# Altium schematic sheet [0X] - CPU - DISP, CSI.SchDoc
size A2
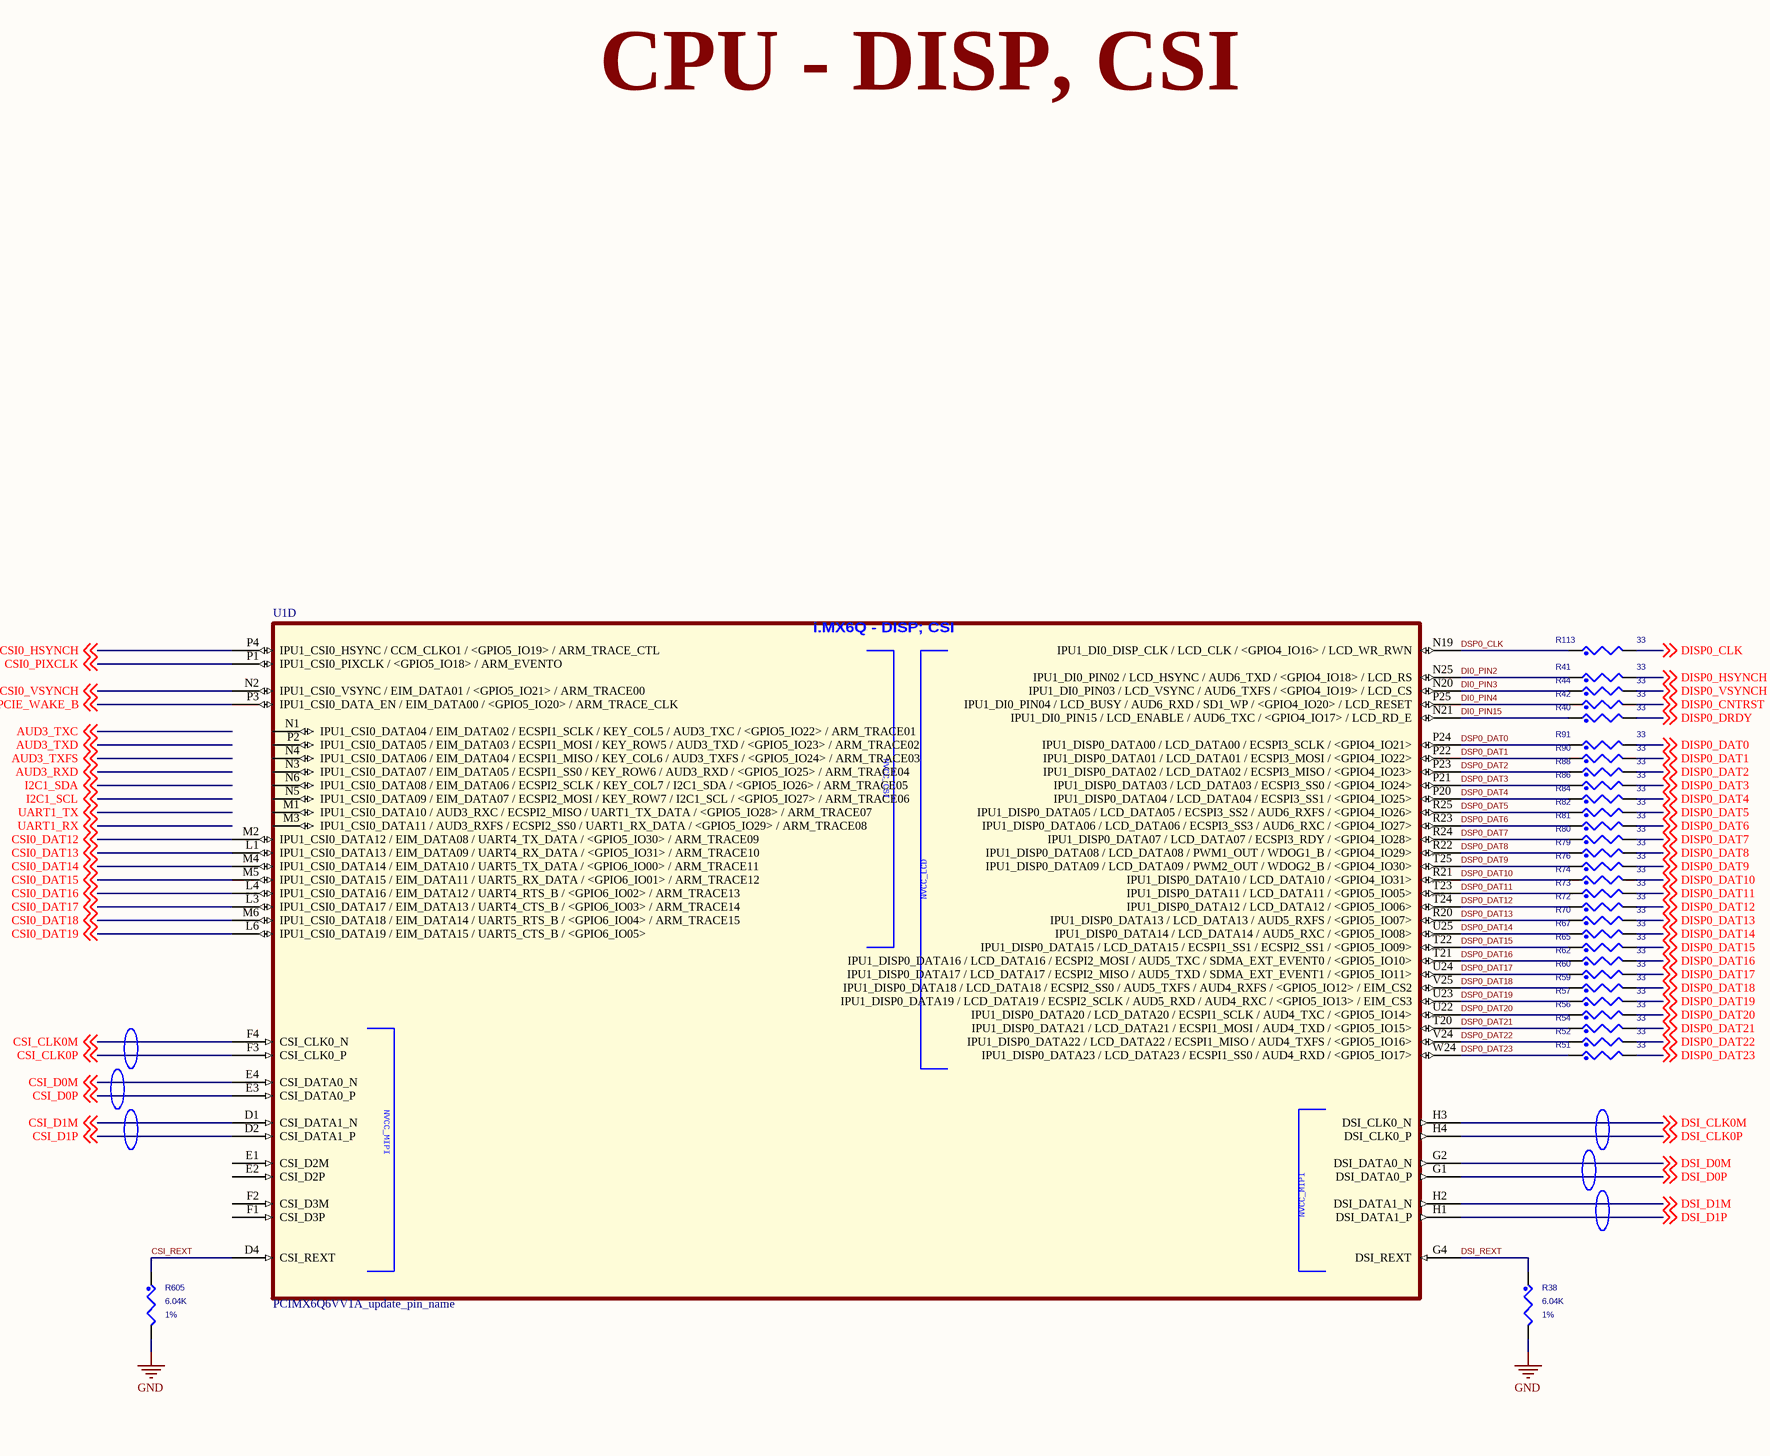
[diagram p0: [0X] - CPU - DISP, CSI.SchDoc, left]
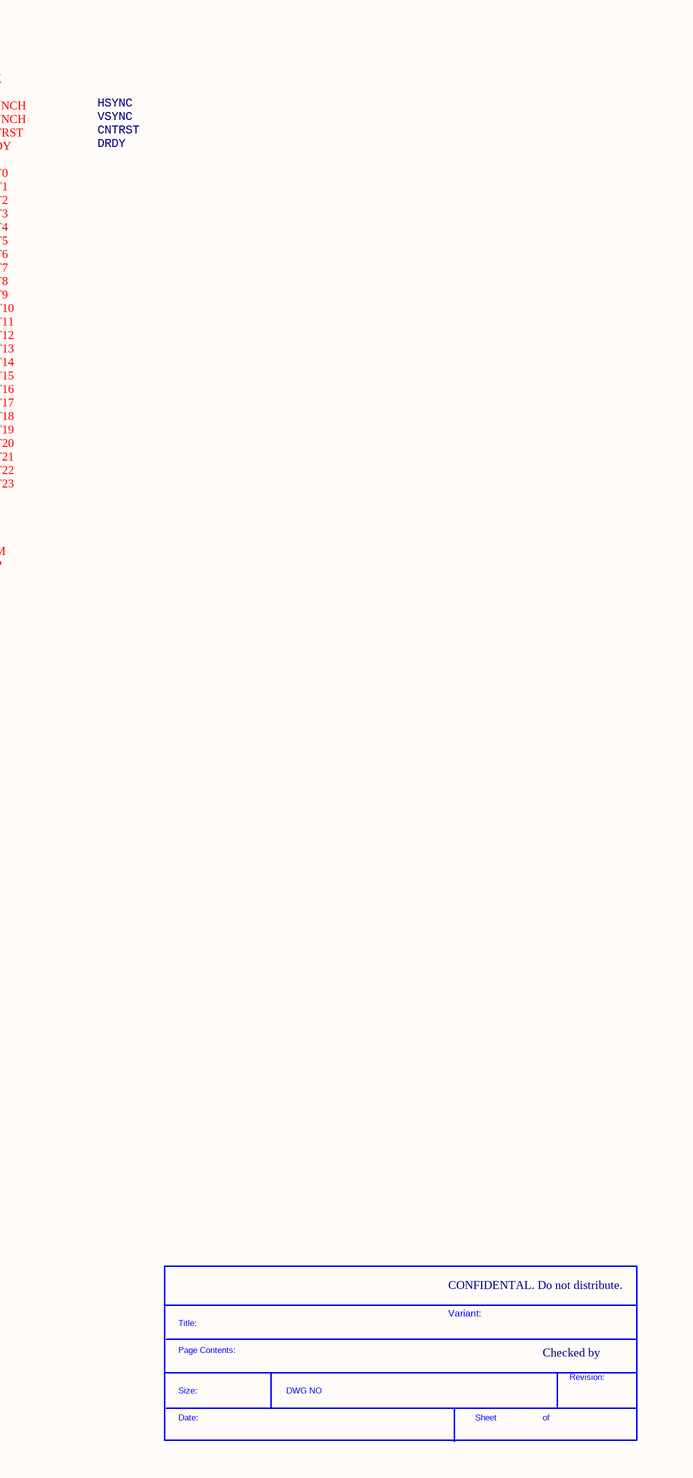
[diagram p1: [0X] - CPU - DISP, CSI.SchDoc, right]

## Parts
*  SDTitleBlock  (value not drawn)  (graphical)
R38  6.04K  Tolerance: 1%  [0402_CC]
R40  33  [0402_CC]
R41  33  [0402_CC]
R42  33  [0402_CC]
R44  33  [0402_CC]
R51  33  [0402_CC]
R52  33  [0402_CC]
R54  33  [0402_CC]
R56  33  [0402_CC]
R57  33  [0402_CC]
R59  33  [0402_CC]
R60  33  [0402_CC]
R62  33  [0402_CC]
R65  33  [0402_CC]
R67  33  [0402_CC]
R70  33  [0402_CC]
R72  33  [0402_CC]
R73  33  [0402_CC]
R74  33  [0402_CC]
R76  33  [0402_CC]
R79  33  [0402_CC]
R80  33  [0402_CC]
R81  33  [0402_CC]
R82  33  [0402_CC]
R84  33  [0402_CC]
R86  33  [0402_CC]
R88  33  [0402_CC]
R90  33  [0402_CC]
R91  33  [0402_CC]
R113  33  [0402_CC]
R605  6.04K  Tolerance: 1%  [0402_CC]
U1  PCIMX6Q6VV1A_update_pin_name  (part D of 17)

## Nets
GND: R38.2 R605.2
CSI0_DAT12: U1.M2(IPU1_CSI0_DATA12_/_EIM_DATA08_/_UART4_TX_DATA_/_<GPIO5_IO30>_/_ARM_TRACE09) ; off-sheet CSI0_DAT12
CSI0_DAT13: U1.L1(IPU1_CSI0_DATA13_/_EIM_DATA09_/_UART4_RX_DATA_/_<GPIO5_IO31>_/_ARM_TRACE10) ; off-sheet CSI0_DAT13
CSI0_DAT14: U1.M4(IPU1_CSI0_DATA14_/_EIM_DATA10_/_UART5_TX_DATA_/_<GPIO6_IO00>_/_ARM_TRACE11) ; off-sheet CSI0_DAT14
CSI0_DAT15: U1.M5(IPU1_CSI0_DATA15_/_EIM_DATA11_/_UART5_RX_DATA_/_<GPIO6_IO01>_/_ARM_TRACE12) ; off-sheet CSI0_DAT15
CSI0_DAT16: U1.L4(IPU1_CSI0_DATA16_/_EIM_DATA12_/_UART4_RTS_B_/_<GPIO6_IO02>_/_ARM_TRACE13) ; off-sheet CSI0_DAT16
CSI0_DAT17: U1.L3(IPU1_CSI0_DATA17_/_EIM_DATA13_/_UART4_CTS_B_/_<GPIO6_IO03>_/_ARM_TRACE14) ; off-sheet CSI0_DAT17
CSI0_DAT18: U1.M6(IPU1_CSI0_DATA18_/_EIM_DATA14_/_UART5_RTS_B_/_<GPIO6_IO04>_/_ARM_TRACE15) ; off-sheet CSI0_DAT18
CSI0_DAT19: U1.L6(IPU1_CSI0_DATA19_/_EIM_DATA15_/_UART5_CTS_B_/_<GPIO6_IO05>) ; off-sheet CSI0_DAT19
CSI0_HSYNCH: U1.P4(IPU1_CSI0_HSYNC_/_CCM_CLKO1_/_<GPIO5_IO19>_/_ARM_TRACE_CTL) ; off-sheet CSI0_HSYNCH
CSI0_PIXCLK: U1.P1(IPU1_CSI0_PIXCLK_/_<GPIO5_IO18>_/_ARM_EVENTO) ; off-sheet CSI0_PIXCLK
CSI0_VSYNCH: U1.N2(IPU1_CSI0_VSYNC_/_EIM_DATA01_/_<GPIO5_IO21>_/_ARM_TRACE00) ; off-sheet CSI0_VSYNCH
CSI_CLK0M: U1.F4(CSI_CLK0_N) ; off-sheet CSI_CLK0M
CSI_CLK0P: U1.F3(CSI_CLK0_P) ; off-sheet CSI_CLK0P
CSI_D0M: U1.E4(CSI_DATA0_N) ; off-sheet CSI_D0M
CSI_D0P: U1.E3(CSI_DATA0_P) ; off-sheet CSI_D0P
CSI_D1M: U1.D1(CSI_DATA1_N) ; off-sheet CSI_D1M
CSI_D1P: U1.D2(CSI_DATA1_P) ; off-sheet CSI_D1P
CSI_REXT: R605.1 U1.D4(CSI_REXT)
DI0_PIN2: R41.1 U1.N25(IPU1_DI0_PIN02_/_LCD_HSYNC_/_AUD6_TXD_/_<GPIO4_IO18>_/_LCD_RS)
DI0_PIN3: R44.1 U1.N20(IPU1_DI0_PIN03_/_LCD_VSYNC_/_AUD6_TXFS_/_<GPIO4_IO19>_/_LCD_CS)
DI0_PIN4: R42.1 U1.P25(IPU1_DI0_PIN04_/_LCD_BUSY_/_AUD6_RXD_/_SD1_WP_/_<GPIO4_IO20>_/_LCD_RESET)
DI0_PIN15: R40.1 U1.N21(IPU1_DI0_PIN15_/_LCD_ENABLE_/_AUD6_TXC_/_<GPIO4_IO17>_/_LCD_RD_E)
DISP0_CLK: R113.2 ; off-sheet DISP0_CLK
DISP0_CNTRST: R42.2 ; off-sheet DISP0_CNTRST
DISP0_DAT0: R91.2 ; off-sheet DISP0_DAT0
DISP0_DAT1: R90.2 ; off-sheet DISP0_DAT1
DISP0_DAT2: R88.2 ; off-sheet DISP0_DAT2
DISP0_DAT3: R86.2 ; off-sheet DISP0_DAT3
DISP0_DAT4: R84.2 ; off-sheet DISP0_DAT4
DISP0_DAT5: R82.2 ; off-sheet DISP0_DAT5
DISP0_DAT6: R81.2 ; off-sheet DISP0_DAT6
DISP0_DAT7: R80.2 ; off-sheet DISP0_DAT7
DISP0_DAT8: R79.2 ; off-sheet DISP0_DAT8
DISP0_DAT9: R76.2 ; off-sheet DISP0_DAT9
DISP0_DAT10: R74.2 ; off-sheet DISP0_DAT10
DISP0_DAT11: R73.2 ; off-sheet DISP0_DAT11
DISP0_DAT12: R72.2 ; off-sheet DISP0_DAT12
DISP0_DAT13: R70.2 ; off-sheet DISP0_DAT13
DISP0_DAT14: R67.2 ; off-sheet DISP0_DAT14
DISP0_DAT15: R65.2 ; off-sheet DISP0_DAT15
DISP0_DAT16: R62.2 ; off-sheet DISP0_DAT16
DISP0_DAT17: R60.2 ; off-sheet DISP0_DAT17
DISP0_DAT18: R59.2 ; off-sheet DISP0_DAT18
DISP0_DAT19: R57.2 ; off-sheet DISP0_DAT19
DISP0_DAT20: R56.2 ; off-sheet DISP0_DAT20
DISP0_DAT21: R54.2 ; off-sheet DISP0_DAT21
DISP0_DAT22: R52.2 ; off-sheet DISP0_DAT22
DISP0_DAT23: R51.2 ; off-sheet DISP0_DAT23
DISP0_DRDY: R40.2 ; off-sheet DISP0_DRDY
DISP0_HSYNCH: R41.2 ; off-sheet DISP0_HSYNCH
DISP0_VSYNCH: R44.2 ; off-sheet DISP0_VSYNCH
DSI_CLK0M: U1.H3(DSI_CLK0_N) ; off-sheet DSI_CLK0M
DSI_CLK0P: U1.H4(DSI_CLK0_P) ; off-sheet DSI_CLK0P
DSI_D0M: U1.G2(DSI_DATA0_N) ; off-sheet DSI_D0M
DSI_D0P: U1.G1(DSI_DATA0_P) ; off-sheet DSI_D0P
DSI_D1M: U1.H2(DSI_DATA1_N) ; off-sheet DSI_D1M
DSI_D1P: U1.H1(DSI_DATA1_P) ; off-sheet DSI_D1P
DSI_REXT: R38.1 U1.G4(DSI_REXT)
DSP0_CLK: R113.1 U1.N19(IPU1_DI0_DISP_CLK_/_LCD_CLK_/_<GPIO4_IO16>_/_LCD_WR_RWN)
DSP0_DAT0: R91.1 U1.P24(IPU1_DISP0_DATA00_/_LCD_DATA00_/_ECSPI3_SCLK_/_<GPIO4_IO21>)
DSP0_DAT1: R90.1 U1.P22(IPU1_DISP0_DATA01_/_LCD_DATA01_/_ECSPI3_MOSI_/_<GPIO4_IO22>)
DSP0_DAT2: R88.1 U1.P23(IPU1_DISP0_DATA02_/_LCD_DATA02_/_ECSPI3_MISO_/_<GPIO4_IO23>)
DSP0_DAT3: R86.1 U1.P21(IPU1_DISP0_DATA03_/_LCD_DATA03_/_ECSPI3_SS0_/_<GPIO4_IO24>)
DSP0_DAT4: R84.1 U1.P20(IPU1_DISP0_DATA04_/_LCD_DATA04_/_ECSPI3_SS1_/_<GPIO4_IO25>)
DSP0_DAT5: R82.1 U1.R25(IPU1_DISP0_DATA05_/_LCD_DATA05_/_ECSPI3_SS2_/_AUD6_RXFS_/_<GPIO4_IO26>)
DSP0_DAT6: R81.1 U1.R23(IPU1_DISP0_DATA06_/_LCD_DATA06_/_ECSPI3_SS3_/_AUD6_RXC_/_<GPIO4_IO27>)
DSP0_DAT7: R80.1 U1.R24(IPU1_DISP0_DATA07_/_LCD_DATA07_/_ECSPI3_RDY_/_<GPIO4_IO28>)
DSP0_DAT8: R79.1 U1.R22(IPU1_DISP0_DATA08_/_LCD_DATA08_/_PWM1_OUT_/_WDOG1_B_/_<GPIO4_IO29>)
DSP0_DAT9: R76.1 U1.T25(IPU1_DISP0_DATA09_/_LCD_DATA09_/_PWM2_OUT_/_WDOG2_B_/_<GPIO4_IO30>)
DSP0_DAT10: R74.1 U1.R21(IPU1_DISP0_DATA10_/_LCD_DATA10_/_<GPIO4_IO31>)
DSP0_DAT11: R73.1 U1.T23(IPU1_DISP0_DATA11_/_LCD_DATA11_/_<GPIO5_IO05>)
DSP0_DAT12: R72.1 U1.T24(IPU1_DISP0_DATA12_/_LCD_DATA12_/_<GPIO5_IO06>)
DSP0_DAT13: R70.1 U1.R20(IPU1_DISP0_DATA13_/_LCD_DATA13_/_AUD5_RXFS_/_<GPIO5_IO07>)
DSP0_DAT14: R67.1 U1.U25(IPU1_DISP0_DATA14_/_LCD_DATA14_/_AUD5_RXC_/_<GPIO5_IO08>)
DSP0_DAT15: R65.1 U1.T22(IPU1_DISP0_DATA15_/_LCD_DATA15_/_ECSPI1_SS1_/_ECSPI2_SS1_/_<GPIO5_IO09>)
DSP0_DAT16: R62.1 U1.T21(IPU1_DISP0_DATA16_/_LCD_DATA16_/_ECSPI2_MOSI_/_AUD5_TXC_/_SDMA_EXT_EVENT0_/_<GPIO5_IO10>)
DSP0_DAT17: R60.1 U1.U24(IPU1_DISP0_DATA17_/_LCD_DATA17_/_ECSPI2_MISO_/_AUD5_TXD_/_SDMA_EXT_EVENT1_/_<GPIO5_IO11>)
DSP0_DAT18: R59.1 U1.V25(IPU1_DISP0_DATA18_/_LCD_DATA18_/_ECSPI2_SS0_/_AUD5_TXFS_/_AUD4_RXFS_/_<GPIO5_IO12>_/_EIM_CS2)
DSP0_DAT19: R57.1 U1.U23(IPU1_DISP0_DATA19_/_LCD_DATA19_/_ECSPI2_SCLK_/_AUD5_RXD_/_AUD4_RXC_/_<GPIO5_IO13>_/_EIM_CS3)
DSP0_DAT20: R56.1 U1.U22(IPU1_DISP0_DATA20_/_LCD_DATA20_/_ECSPI1_SCLK_/_AUD4_TXC_/_<GPIO5_IO14>)
DSP0_DAT21: R54.1 U1.T20(IPU1_DISP0_DATA21_/_LCD_DATA21_/_ECSPI1_MOSI_/_AUD4_TXD_/_<GPIO5_IO15>)
DSP0_DAT22: R52.1 U1.V24(IPU1_DISP0_DATA22_/_LCD_DATA22_/_ECSPI1_MISO_/_AUD4_TXFS_/_<GPIO5_IO16>)
DSP0_DAT23: R51.1 U1.W24(IPU1_DISP0_DATA23_/_LCD_DATA23_/_ECSPI1_SS0_/_AUD4_RXD_/_<GPIO5_IO17>)
PCIE_WAKE_B: U1.P3(IPU1_CSI0_DATA_EN_/_EIM_DATA00_/_<GPIO5_IO20>_/_ARM_TRACE_CLK) ; off-sheet PCIE_WAKE_B

Not connected (* = marked no-connect by the designer): U1 E1(CSI_D2M) E2(CSI_D2P) F1(CSI_D3P) F2(CSI_D3M) M1(IPU1_CSI0_DATA10_/_AUD3_RXC_/_ECSPI2_MISO_/_UART1_TX_DATA_/_<GPIO5_IO28>_/_ARM_TRACE07) M3(IPU1_CSI0_DATA11_/_AUD3_RXFS_/_ECSPI2_SS0_/_UART1_RX_DATA_/_<GPIO5_IO29>_/_ARM_TRACE08) N1(IPU1_CSI0_DATA04_/_EIM_DATA02_/_ECSPI1_SCLK_/_KEY_COL5_/_AUD3_TXC_/_<GPIO5_IO22>_/_ARM_TRACE01) N3(IPU1_CSI0_DATA07_/_EIM_DATA05_/_ECSPI1_SS0_/_KEY_ROW6_/_AUD3_RXD_/_<GPIO5_IO25>_/_ARM_TRACE04) N4(IPU1_CSI0_DATA06_/_EIM_DATA04_/_ECSPI1_MISO_/_KEY_COL6_/_AUD3_TXFS_/_<GPIO5_IO24>_/_ARM_TRACE03) N5(IPU1_CSI0_DATA09_/_EIM_DATA07_/_ECSPI2_MOSI_/_KEY_ROW7_/_I2C1_SCL_/_<GPIO5_IO27>_/_ARM_TRACE06) N6(IPU1_CSI0_DATA08_/_EIM_DATA06_/_ECSPI2_SCLK_/_KEY_COL7_/_I2C1_SDA_/_<GPIO5_IO26>_/_ARM_TRACE05) P2(IPU1_CSI0_DATA05_/_EIM_DATA03_/_ECSPI1_MOSI_/_KEY_ROW5_/_AUD3_TXD_/_<GPIO5_IO23>_/_ARM_TRACE02)

## Notes on the sheet
- CPU - DISP, CSI
- HSYNC
- CNTRST
- VSYNC
- DRDY
- CONFIDENTAL. Do not distribute.
- Variant:
- Checked by
- (in symbol PCIMX6Q6VV1A_update_pin_name, part D) i.MX6Q - DISP; CSI
- (in symbol SDTitleBlock) Title:; Page Contents:; Revision:; Size:; DWG NO; Date:; Sheet; of

## Library data of the parts
R38 = RES: RES MF 6.04K  1/16W 1% 0402; CLASS: DISCRETE; PRIORITY_PN: 006-01007; FPLIST: RC0402_25,RC0402_HD,0402_CC; CAD_APPROVED: Yes; MFG_PN01: RK73H1ETTP6041F; MFG_NAME01: KOA SPEER; AGILE_PN: 470-30923; SIGNAL_MODEL: DEFAULT_RESISTOR_6040OHM_2_1; ROHS: Yes
R40-R42 R44 R59 = RES: RES MF 33 OHM 1/16W 5% 0402; CLASS: DISCRETE; FPLIST: RC0402_25,RC0402_HD,0402_CC; CAD_APPROVED: Yes; MFG_PN01: RC73L2Z330JTF; MFG_NAME01: SMEC; AGILE_PN: 470-75634; SIGNAL_MODEL: DEFAULT_RESISTOR_33OHM_2_1; ROHS: Yes; Tolerance: 5%
R51 R52 R54 R56 R57 R60 R62 R65 R67 R70 R72-R74 R76 R79-R82 R84 R86 R88 R90 R91 R113 = RES: RES MF 33 OHM 1/16W 5% 0402; CLASS: DISCRETE; AGILE_PN: 470-75634; MFG_NAME01: SMEC; MFG_PN01: RC73L2Z330JTF; CAD_APPROVED: Yes; FPLIST: RC0402_25,RC0402_HD,0402_CC; SIGNAL_MODEL: DEFAULT_RESISTOR_33OHM_2_1; Tolerance: 5%; ROHS: Yes
R605 = RES: RES MF 6.04K  1/16W 1% 0402; CLASS: DISCRETE; AGILE_PN: 470-30923; MFG_NAME01: KOA SPEER; MFG_PN01: RK73H1ETTP6041F; CAD_APPROVED: Yes; FPLIST: RC0402_25,RC0402_HD,0402_CC; PRIORITY_PN: 006-01007; SIGNAL_MODEL: DEFAULT_RESISTOR_6040OHM_2_1; ROHS: Yes
U1 = PCIMX6Q6VV1A_update_pin_name: CLASS: IC